# Altium project smart_mask_v_1_0.PrjPcb
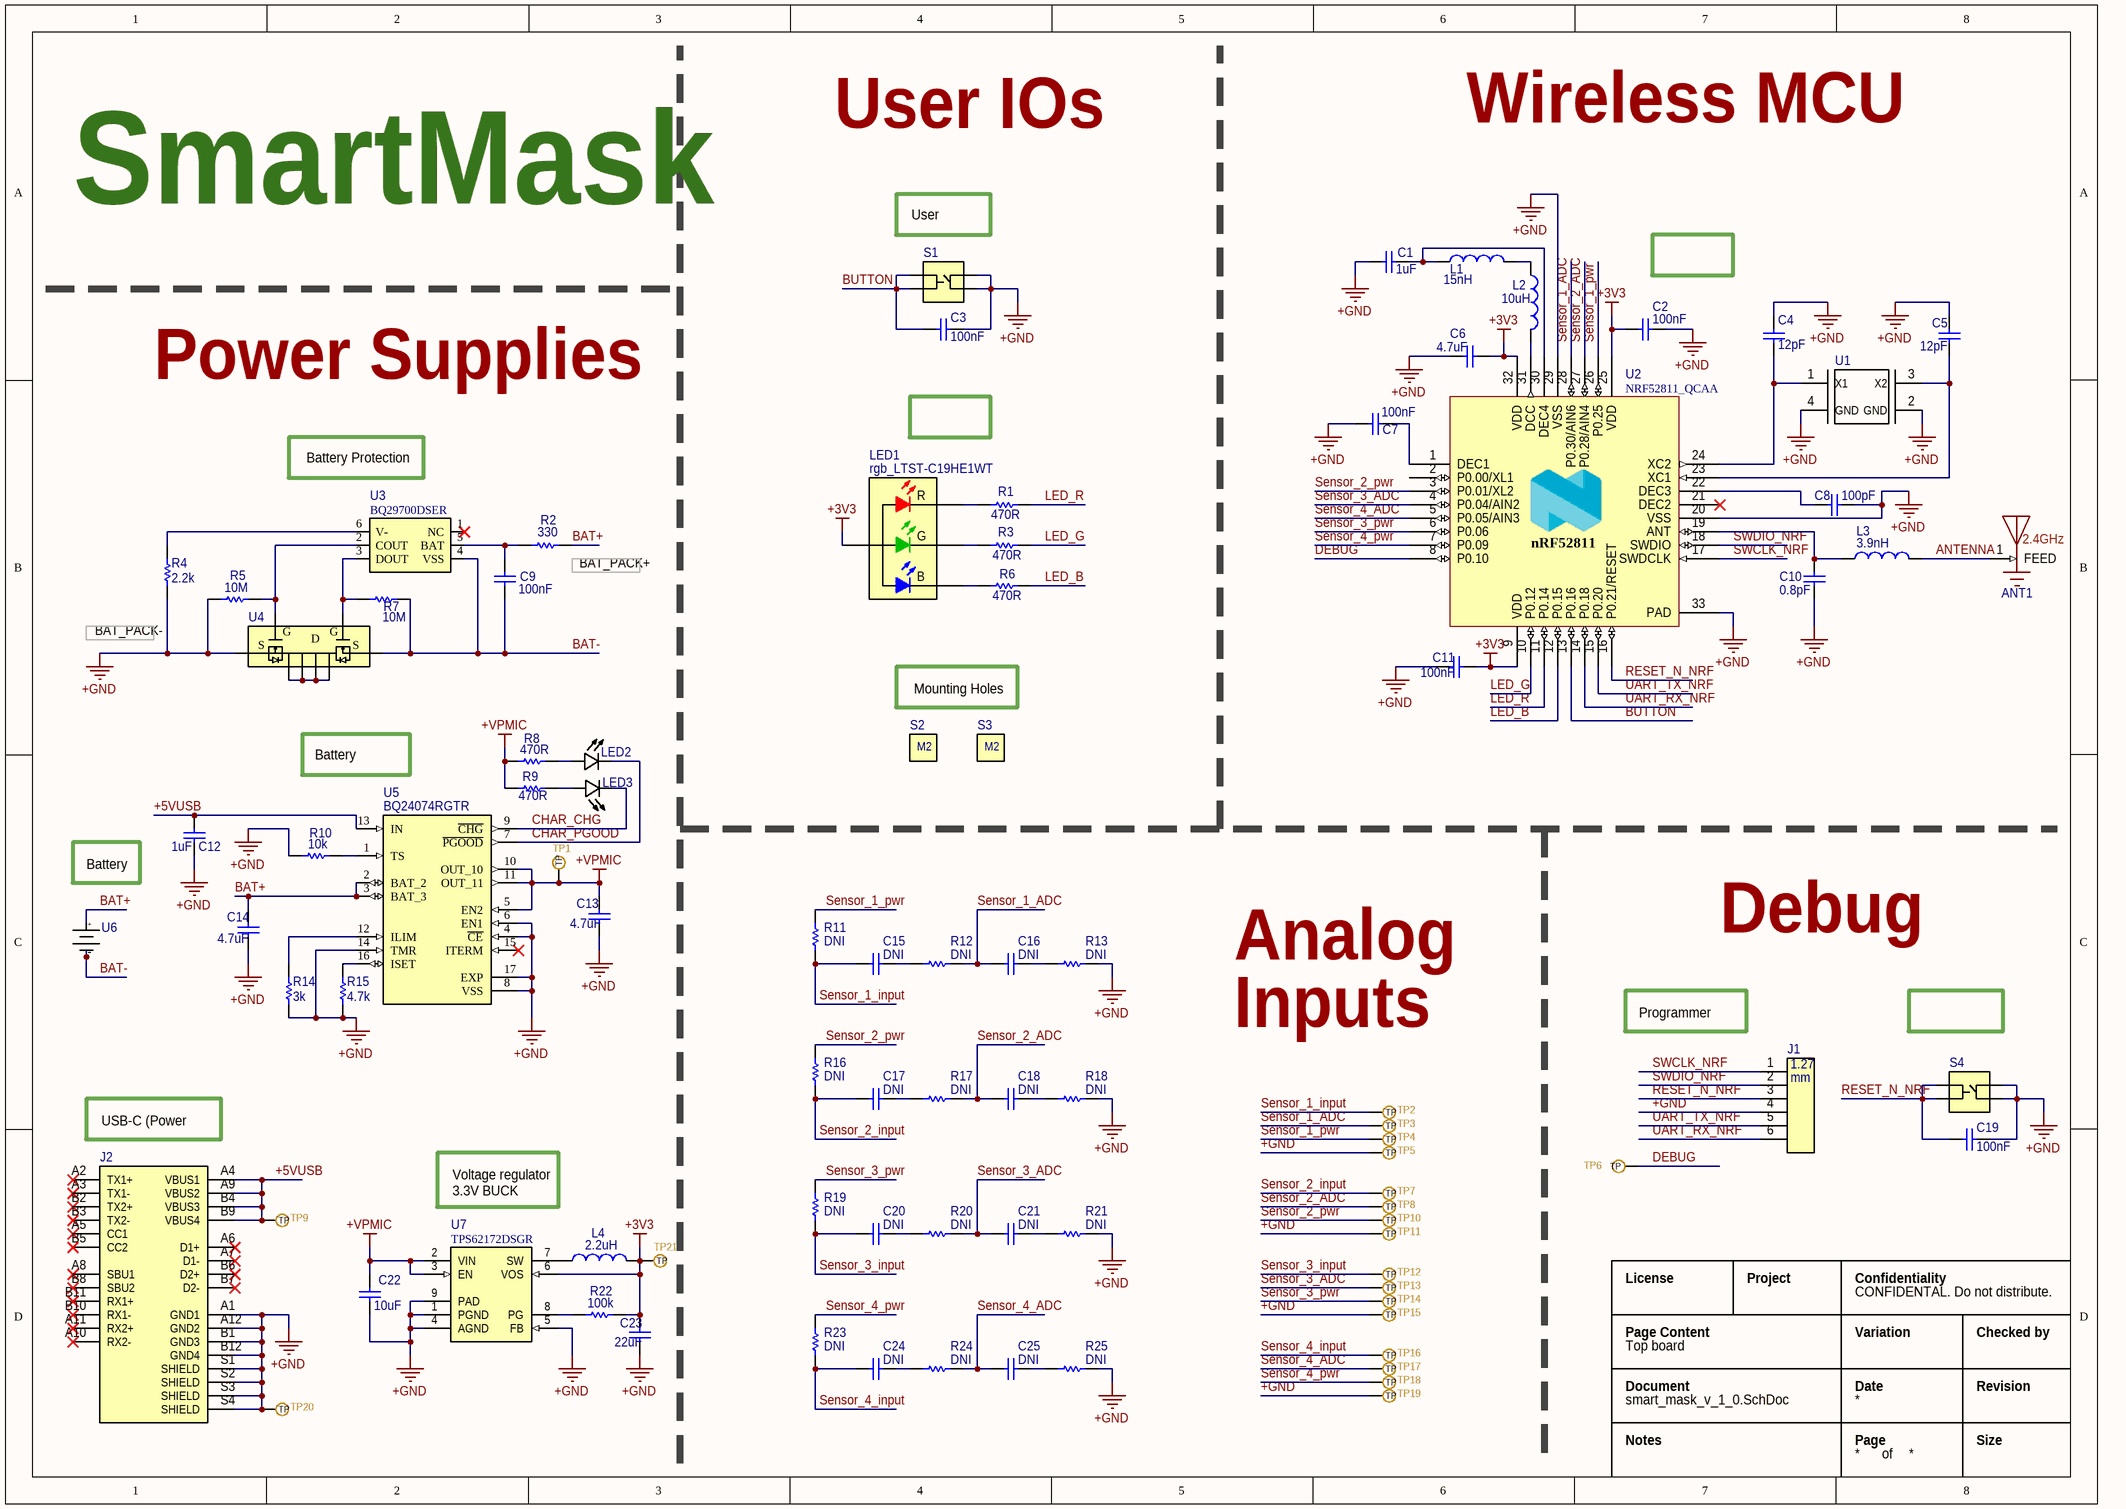
[diagram p0: smart_mask_v_1_0.SchDoc]
1 sheet, 92 parts. Net scope: global (net labels, ports and power ports of the same name join across sheets).
Board file: smart_mask_v_1_0.PcbDoc

## Sheet smart_mask_v_1_0.SchDoc
size A3

### Parts
ANT1  2450AT43F0100E  [ANT_2450AT43F0100E]  (value not drawn)
C1  value 1uF  [C0603]  (hidden comment: Multilayer Ceramic Capacitor)
C2  value 100nF  [C0402]  (hidden comment: Multilayer Ceramic Capacitor)
C3  value 100nF  [C0402]  (hidden comment: Multilayer Ceramic Capacitor)
C4  value 12pF  [C0402]  (hidden comment: Multilayer Ceramic Capacitor)
C5  value 12pF  [C0402]  (hidden comment: Multilayer Ceramic Capacitor)
C6  value 4.7uF  [C0603]  (hidden comment: Multilayer Ceramic Capacitor)
C7  value 100nF  [C0402]  (hidden comment: Multilayer Ceramic Capacitor)
C8  value 100pF  [C0402]  (hidden comment: Multilayer Ceramic Capacitor)
C9  value 100nF  [C0402]  (hidden comment: Multilayer Ceramic Capacitor)
C10  value 0.8pF  [C0402]  (hidden comment: Multilayer Ceramic Capacitor)
C11  value 100nF  [C0402]  (hidden comment: Multilayer Ceramic Capacitor)
C12  value 1uF  [C0402]  (hidden comment: Multilayer Ceramic Capacitor)
C13  value 4.7uF  [C0402]  (hidden comment: Multilayer Ceramic Capacitor)
C14  value 4.7uF  [C0402]  (hidden comment: Multilayer Ceramic Capacitor)
C15  value DNI  [C0603_DNI]  (hidden comment: Multilayer Ceramic Capacitor)
C16  value DNI  [C0603_DNI]  (hidden comment: Multilayer Ceramic Capacitor)
C17  value DNI  [C0603_DNI]  (hidden comment: Multilayer Ceramic Capacitor)
C18  value DNI  [C0603_DNI]  (hidden comment: Multilayer Ceramic Capacitor)
C19  value 100nF  [C0402]  (hidden comment: Multilayer Ceramic Capacitor)
C20  value DNI  [C0603_DNI]  (hidden comment: Multilayer Ceramic Capacitor)
C21  value DNI  [C0603_DNI]  (hidden comment: Multilayer Ceramic Capacitor)
C22  value 10uF  [C0402]  (hidden comment: Multilayer Ceramic Capacitor)
C23  value 22uF  [C0603]  (hidden comment: Multilayer Ceramic Capacitor)
C24  value DNI  [C0603_DNI]  (hidden comment: Multilayer Ceramic Capacitor)
C25  value DNI  [C0603_DNI]  (hidden comment: Multilayer Ceramic Capacitor)
J1  FTS-103-01-F-DV-TR  [CON_6_2_1.27_FTS_103_01]  (value not drawn)
J2  1054500101  [USB-C-1054500101]  (value not drawn)
L1  value 15nH  [L0402]  (hidden comment: IND 15nH 0402)
L2  value 10uH  [L0603]  (hidden comment: IND 10uH 0603)
L3  value 3.9nH  [L0402]  (hidden comment: IND 3.9nH 0402)
L4  value 2.2uH  [L0603]  (hidden comment: IND 2.2uH 0603)
LED1  rgb_LTST-C19HE1WT  [LTST-C19HE1WT-4_V]
LED2  LTST-C190CKT  [LTST-C190CKT]  (value not drawn)
LED3  LTST-C190CKT  [LTST-C190CKT]  (value not drawn)
R1  value 470R  [R0402]  (hidden comment: Thick Film)
R2  value 330  [R0402]  (hidden comment: Thick Film)
R3  value 470R  [R0402]  (hidden comment: Thick Film)
R4  value 2.2k  [R0402]  (hidden comment: Thick Film)
R5  value 10M  [R0402]  (hidden comment: Thick Film)
R6  value 470R  [R0402]  (hidden comment: Thick Film)
R7  value 10M  [R0402]  (hidden comment: Thick Film)
R8  value 470R  [R0402]  (hidden comment: Thick Film)
R9  value 470R  [R0402]  (hidden comment: Thick Film)
R10  value 10k  [R0402]  (hidden comment: Thick Film)
R11  value DNI  [R0603_DNI]  (hidden comment: RES DNI 0603)
R12  value DNI  [R0603_DNI]  (hidden comment: RES DNI 0603)
R13  value DNI  [R0603_DNI]  (hidden comment: RES DNI 0603)
R14  value 3k  [R0402]  (hidden comment: Thick Film)
R15  value 4.7k  [R0402]  (hidden comment: Thick Film)
R16  value DNI  [R0603_DNI]  (hidden comment: RES DNI 0603)
R17  value DNI  [R0603_DNI]  (hidden comment: RES DNI 0603)
R18  value DNI  [R0603_DNI]  (hidden comment: RES DNI 0603)
R19  value DNI  [R0603_DNI]  (hidden comment: RES DNI 0603)
R20  value DNI  [R0603_DNI]  (hidden comment: RES DNI 0603)
R21  value DNI  [R0603_DNI]  (hidden comment: RES DNI 0603)
R22  value 100k  [R0402]  (hidden comment: Thick Film)
R23  value DNI  [R0603_DNI]  (hidden comment: RES DNI 0603)
R24  value DNI  [R0603_DNI]  (hidden comment: RES DNI 0603)
R25  value DNI  [R0603_DNI]  (hidden comment: RES DNI 0603)
S1  TL1014BF160QG  [BUTTON_TL1014BF160QG]  (value not drawn)
S2  hole_M2  [M2_no_screw]  (value not drawn)
S3  hole_M2  [M2_no_screw]  (value not drawn)
S4  TL1014BF160QG  [BUTTON_TL1014BF160QG]  (value not drawn)
TP1  TP_1mm  [TP_1mm]  (value not drawn)
TP2  TP_2mm  [TP_2mm]  (value not drawn)
TP3  TP_2mm  [TP_2mm]  (value not drawn)
TP4  TP_2mm  [TP_2mm]  (value not drawn)
TP5  TP_2mm  [TP_2mm]  (value not drawn)
TP6  TP_2mm  [TP_2mm]  (value not drawn)
TP7  TP_2mm  [TP_2mm]  (value not drawn)
TP8  TP_2mm  [TP_2mm]  (value not drawn)
TP9  TP_1mm  [TP_1mm]  (value not drawn)
TP10  TP_2mm  [TP_2mm]  (value not drawn)
TP11  TP_2mm  [TP_2mm]  (value not drawn)
TP12  TP_2mm  [TP_2mm]  (value not drawn)
TP13  TP_2mm  [TP_2mm]  (value not drawn)
TP14  TP_2mm  [TP_2mm]  (value not drawn)
TP15  TP_2mm  [TP_2mm]  (value not drawn)
TP16  TP_2mm  [TP_2mm]  (value not drawn)
TP17  TP_2mm  [TP_2mm]  (value not drawn)
TP18  TP_2mm  [TP_2mm]  (value not drawn)
TP19  TP_2mm  [TP_2mm]  (value not drawn)
TP20  TP_1mm  [TP_1mm]  (value not drawn)
TP21  TP_1mm  [TP_1mm]  (value not drawn)
U1  ABM11W-32.0000MHZ-8-B1U-T3  [XTAL_32MHz_ABM11W-32.0000MHZ-8-B1U-T3]  (value not drawn)
U2  NRF52811_QCAA  [NRF52811_QCAA]
U3  BQ29700DSER  [BATT_PROTEC_BQ29700DSER]
U4  ECH8693R-TL-W  [MOSFET_2CHAN_ECH8693R-TL-W]  (value not drawn)
U5  BQ24074RGTR  [BATT_CHARG_BQ24074RGTR]
U6  RJD2430C1ST1  [COIN_BAT_110_MAH_RJD2430C1ST1]  (value not drawn)
U7  TPS62172DSGR  [REG_BUCK_TPS62172DSGR]

### Nets
+3V3: C2.2 C6.1 C11.1 C23.2 L4.2 LED1.4(A) R22.2 TP21.1(TP) U2.9(VDD) U2.25(VDD) U2.32(VDD) U7.6(VOS)
+GND: C1.1 C2.1 C3.2 C4.2 C5.2 C6.2 C7.2 C8.2 C10.1 C11.2 C12.1 C13.1 C14.1 C19.2 C22.1 C23.1 J1.4 J2.A1(GND1) J2.A12(GND2) J2.B1(GND3) J2.B12(GND4) J2.S1(SHIELD) J2.S2(SHIELD) J2.S3(SHIELD) J2.S4(SHIELD) R4.1 R5.2 R10.2 R13.2 R14.1 R15.1 R18.2 R21.2 R25.2 S1.2 S1.4 S4.2 S4.4 TP5.1(TP) TP11.1(TP) TP15.1(TP) TP19.1(TP) TP20.1(TP) U1.2(GND) U1.4(GND) U2.20(VSS) U2.29(VSS) U2.33(PAD) U4.1(S1) U5.4(~{CE}) U5.6(EN1) U5.8(VSS) U5.14(TMR) U5.17(EXP) U7.1(PGND) U7.4(AGND) U7.5(FB) U7.9(PAD)
+VPMIC: C13.2 C22.2 R8.2 R9.2 TP1.1(TP) U5.5(EN2) U5.10(OUT_10) U5.11(OUT_11) U7.2(VIN) U7.3(EN)
+5VUSB: C12.2 J2.A4(VBUS1) J2.A9(VBUS2) J2.B4(VBUS3) J2.B9(VBUS4) TP9.1(TP) U5.13(IN)
ANTENNA: ANT1.1(FEED) L3.2
BAT+: C14.2 R2.2 U5.2(BAT_2) U5.3(BAT_3) U6.1(+)
BAT-: C9.1 R7.1 U3.4(VSS) U4.3(S2) U6.2(-)
BUTTON: C3.1 S1.1 S1.3 U2.13(P0.16)
CHAR_CHG: LED3.C U5.9(~{CHG})
CHAR_PGOOD: LED2.C U5.7(~{PGOOD})
DEBUG: TP6.1(TP) U2.8(P0.10)
LED_B: R6.2 U2.12(P0.15)
LED_G: R3.2 U2.10(P0.12)
LED_R: R1.2 U2.11(P0.14)
RESET_N_NRF: C19.1 J1.3 S4.1 S4.3 U2.16(P0.21/RESET)
Sensor_1_ADC: C16.1 R12.2 TP3.1(TP) U2.28(P0.30/AIN6)
Sensor_1_input: C15.1 R11.1 TP2.1(TP)
Sensor_1_pwr: R11.2 TP4.1(TP) U2.26(P0.25)
Sensor_2_ADC: C18.1 R17.2 TP8.1(TP) U2.27(P0.28/AIN4)
Sensor_2_input: C17.1 R16.1 TP7.1(TP)
Sensor_2_pwr: R16.2 TP10.1(TP) U2.3(P0.01/XL2)
Sensor_3_ADC: C21.1 R20.2 TP13.1(TP) U2.4(P0.04/AIN2)
Sensor_3_input: C20.1 R19.1 TP12.1(TP)
Sensor_3_pwr: R19.2 TP14.1(TP) U2.6(P0.06)
Sensor_4_ADC: C25.1 R24.2 TP17.1(TP) U2.5(P0.05/AIN3)
Sensor_4_input: C24.1 R23.1 TP16.1(TP)
Sensor_4_pwr: R23.2 TP18.1(TP) U2.7(P0.09)
SWCLK_NRF: J1.1 U2.17(SWDCLK)
SWDIO_NRF: J1.2 U2.18(SWDIO)
UART_RX_NRF: J1.6 U2.14(P0.18)
UART_TX_NRF: J1.5 U2.15(P0.20)
NetC1_2: C1.2 L1.1 U2.30(DEC4)
NetC4_1: C4.1 U1.1(X1) U2.24(XC2)
NetC5_1: C5.1 U1.3(X2) U2.23(XC1)
NetC7_1: C7.1 U2.1(DEC1)
NetC8_1: C8.1 U2.22(DEC3)
NetC9_2: C9.2 R2.1 U3.5(BAT)
NetC10_2: C10.2 L3.1 U2.19(ANT)
NetC15_2: C15.2 R12.1
NetC16_2: C16.2 R13.1
NetC17_2: C17.2 R17.1
NetC18_2: C18.2 R18.1
NetC20_2: C20.2 R20.1
NetC21_2: C21.2 R21.1
NetC24_2: C24.2 R24.1
NetC25_2: C25.2 R25.1
NetL1_2: L1.2 L2.1
NetL2_2: L2.2 U2.31(DCC)
NetL4_1: L4.1 U7.7(SW)
NetLED1_1: LED1.1(R) R1.1
NetLED1_2: LED1.2(G) R3.1
NetLED1_3: LED1.3(B) R6.1
NetLED2_A: LED2.A R8.1
NetLED3_A: LED3.A R9.1
NetR4_2: R4.2 U3.6(V-)
NetR5_1: R5.1 U3.2(COUT) U4.2(G1)
NetR7_2: R7.2 U3.3(DOUT) U4.4(G2)
NetR10_1: R10.1 U5.1(TS)
NetR14_2: R14.2 U5.12(ILIM)
NetR15_2: R15.2 U5.16(ISET)
NetR22_1: R22.1 U7.8(PG)
NetU4_5: U4.5(D) U4.6(D) U4.7(D) U4.8(D)

Not connected (* = marked no-connect by the designer): J2 A2(TX1+)* A3(TX1-)* A5(CC1)* A6(D1+)* A7(D1-)* A8(SBU1)* A10(RX2-)* A11(RX2+)* B2(TX2+)* B3(TX2-)* B5(CC2)* B6(D2+)* B7(D2-)* B8(SBU2)* B10(RX1-)* B11(RX1+)*; U2 2(P0.00/XL1) 21(DEC2)*; U3 1(NC)*; U5 15(ITERM)*

### Notes on the sheet
- User IOs
- Wireless MCU
- SmartMask
- User button
- NRF52811
- Power Supplies
- LED RGB
- Battery Protection
- (near R2) BAT_PACK+
- (near R4) BAT_PACK-
- Mounting Holes
- Battery Charger
- Battery
- Analog
- Debug
- Inputs
- Programmer Pins
- Reset button
- (near J2) USB-C (Power Only)
- Voltage regulator
  3.3V BUCK
- License
- Project
- CONFIDENTAL. Do not distribute.
- Confidentiality
- Page Content
- Document
- Top board
- Variation
- Date
- Checked by
- Revision
- Notes
- Page
- of
- Size
- (in symbol 2450AT43F0100E) 2.4GHz
- (in symbol ECH8693R-TL-W) G; S
- (in symbol FTS-103-01-F-DV-TR) 1.27; mm
- (in symbol hole_M2) M2
- (in symbol NRF52811_QCAA) nRF52811

### Library data of the parts
ANT1 = 2450AT43F0100E: RF ANT 2.4GHZ CHIP SOLDER SMD; Manufacturer: Johanson Technology Inc.; ComponentLink1Description: Manufacturer URL; ComponentLink2Description: Datasheet; Link: https://www.digikey.com/en/products/detail/johanson-technology-inc/2450AT43F0100E/4824788; Supplier Part Number: 712-1600-1-ND; Supplier: Digikey; Price 1000+ Units USD: 0.36; Price 1 Unit USD: 0.84; Manufacturer Part Number: 2450AT43F0100E
C1 = CAP 1uF 0603: CAP CER 1UF 10V X5R 0603; Manufacturer Part Number: CL10A105KP8NNNC; Manufacturer: Samsung Electro-Mechanics; Voltage Rating: 16V; Supplier Part Number: 1276-1182-1-ND; Package: 0603; Link: https://www.digikey.com/product-detail/en/samsung-electro-mechanics/CL10A105KP8NNNC/1276-1182-1-ND/3889268; Supplier: Digikey
C2 C3 C7 C9 C11 C19 = CAP 100nF 0402: CAP CER 0.1UF 16V X7R 0402; Manufacturer Part Number: GRM155R71C104KA88J; Manufacturer: Murata Electronics; Supplier Part Number: 490-6328-1-ND; Voltage Rating: 16V; Package: 0402; Link: https://www.digikey.com/product-detail/en/murata-electronics/GRM155R71C104KA88J/490-6328-1-ND/3845525; Supplier: Digikey
C4 C5 = CAP 12pF 0402: CAP CER 12PF 50V C0G/NP0 0402; Manufacturer Part Number: GRM1555C1H120JA01J; Manufacturer: Murata Electronics; Supplier Part Number: 490-11375-1-ND; Voltage Rating: 50v; Package: 0402; Link: https://www.digikey.com/product-detail/en/murata-electronics/GRM1555C1H120JA01J/490-11375-1-ND/5333215; Supplier: Digikey
C6 = CAP 4.7uF 0603: CAP CER 4.7UF 10V X5R 0603; Manufacturer Part Number: CL10A475KP8NNNC; Manufacturer: Samsung Electro-Mechanics; Supplier Part Number: 1276-1044-1-ND; Voltage Rating: 10V; Package: 0603; Link: https://www.digikey.com/product-detail/en/samsung-electro-mechanics/CL10A475KP8NNNC/1276-1044-1-ND/3889130; Supplier: Digikey
C8 = CAP 100pF 0402: CAP CER 100PF 50V C0G/NP0 0402; Manufacturer Part Number: GRM1555C1H101JA01J; Manufacturer: Murata Electronics; Supplier Part Number: 490-7754-1-ND; Voltage Rating: 50v; Package: 0402; Link: https://www.digikey.com/product-detail/en/murata-electronics/GRM1555C1H101JA01J/490-7754-1-ND/4358006; Supplier: Digikey
C10 = CAP 0.8pF 0402: CAP CER 0.8PF 50V C0G/NP0 0402; Manufacturer Part Number: GRM1555C1HR80BA01J; Manufacturer: Murata Electronics; Supplier Part Number: 490-11411-1-ND; Voltage Rating: 50v; Package: 0402; Link: https://www.digikey.com/product-detail/en/murata-electronics/GRM1555C1HR80BA01J/490-11411-1-ND/5333251; Supplier: Digikey
C12 = CAP 1uF 0402: CAP CER 1UF 10V X6S 0402; Manufacturer Part Number: GRM155C81A105KA12D; Manufacturer: Murata Electronics; Supplier Part Number: 490-12699-1-ND; Voltage Rating: 10V; Package: 0402; Link: https://www.digikey.com/product-detail/en/murata-electronics/GRM155C81A105KA12D/490-12699-1-ND/5797668; Supplier: Digikey
C13 C14 = CAP 4.7uF 0402: CAP CER 4.7UF 6.3V X5R 0402; Manufacturer Part Number: GRM155R60J475ME47D; Manufacturer: Murata Electronics; Supplier Part Number: 490-5915-1-ND; Voltage Rating: 6.3V; Package: 0402; Link: https://www.digikey.com/product-detail/en/murata-electronics/GRM155R60J475ME47D/490-5915-1-ND/3719860; Supplier: Digikey
C15-C18 C20 C21 C24 C25 = Cap DNI 0603: DNI (Do Not Install)
C22 = CAP 10uF 0402: CAP CER 10UF 4V X5R 0402; Manufacturer Part Number: GRM155R60G106ME44D; Manufacturer: Murata Electronics; Supplier Part Number: 490-10693-1-ND; Voltage Rating: 4V; Package: 0402; Link: https://www.digikey.com/product-detail/en/murata-electronics/GRM155R60G106ME44D/490-10693-1-ND/5251412; Supplier: Digikey
C23 = CAP 22uF 0603: CAP CER 22UF 6.3V X5R 0603; Manufacturer Part Number: GRM188R60J226MEA0D; Manufacturer: Murata Electronics; Supplier Part Number: 490-7611-1-ND; Voltage Rating: 6.3V; Package: 0603; Link: https://www.digikey.com/product-detail/en/murata-electronics/GRM188R60J226MEA0D/490-7611-1-ND/4280544; Supplier: Digikey
J1 = FTS-103-01-F-DV-TR: CONN HEADER SMD 6POS 1.27MM; Manufacturer: Samtec Inc.; zz Current Rating Per Pin: 3.4A; Supplier Part Number: SAM14930CT-ND; Link: https://www.digikey.com/en/products/detail/samtec-inc/FTS-103-01-F-DV-TR/2649936; Manufacturer Part Number: FTS-103-01-F-DV-TR; Supplier: Digikey; Price 1000+ Units USD: 0.78; Price 1 Unit USD: 1.39
J2 = 1054500101: USB-C CONN RCP USB3.1 TYPEC 24P SMD RA; Manufacturer: Molex; zz Current Rating Per Pin: 0.25A, 1A, 5A; Supplier Part Number: WM12856CT-ND; Link: https://www.digikey.com/en/products/detail/molex/1054500101/5843890; Manufacturer Part Number: 1054500101; Supplier: Digikey; Price 1000+ Units USD: 2.19; Price 1 Unit USD: 1.10
L1 = IND 15nH 0402: FIXED IND 15NH 450MA 320 MOHM; Manufacturer: Murata Electronics; Manufacturer Part Number: LQG15HS15NJ02D; Tolerance: 5%; Supplier Part Number: 490-2625-1-ND; Package: 0603; Link: https://www.digikey.com/product-detail/en/murata-electronics/LQG15HS15NJ02D/490-2625-1-ND/662905; Supplier: Digikey
L2 = IND 10uH 0603: FIXED IND 10UH 50MA 900 MOHM SMD; Manufacturer: Murata Electronics; Manufacturer Part Number: LQM18FN100M00D; Tolerance: 20%; Supplier Part Number: 490-4025-1-ND; Package: 0603; Link: https://www.digikey.com/product-detail/en/murata-electronics/LQM18FN100M00D/490-4025-1-ND/1016285; Supplier: Digikey
L3 = IND 3.9nH 0402: FIXED IND 3.9NH 750MA 180 MOHM; Manufacturer: Murata Electronics; Manufacturer Part Number: LQG15HS3N9S02D; Tolerance: 5%; Supplier Part Number: 490-2617-1-ND; Package: 0603; Link: https://www.digikey.com/product-detail/en/murata-electronics/LQG15HS3N9S02D/490-2617-1-ND/662897; Supplier: Digikey
L4 = IND 2.2uH 0603: 2.2UH20% 1.05A(MAX) / 1.15A(TYP.; Manufacturer: Murata Electronics; Manufacturer Part Number: LQM18PN2R2MGHD; Tolerance: 20%; Supplier Part Number: 490-14478-6-ND; Package: 0603; Link: https://www.digikey.co.uk/product-detail/en/murata-electronics/LQM18PN2R2MGHD/490-14478-6-ND/6607082; Supplier: Digikey
LED1 = rgb_LTST-C19HE1WT: LED RGB DIFFUSED CHIP SMD / LED Tri-Color Blue/Green/Red, 5 V, -20 to 80 degC, 4-Pin SMD, RoHS, Tape and Reel; Manufacturer: Lite-On Inc.; zz Package: 0606; zz Power Supply Rating: 2.1V Red, 3.35V Green, 3.35V Blue; Supplier: Digikey; Manufacturer Part Number: LTST-C19HE1WT; Link: https://www.digikey.com/product-detail/en/lite-on-inc/LTST-C19HE1WT/160-2162-1-ND/4866310; Price 1 Unit USD: 0.56; Price 1000+ Units USD: 0.13; Supplier Part Number: 160-2162-1-ND
LED2 LED3 = LTST-C190CKT: LED RED CLEAR CHIP SMD; Manufacturer: Lite-On Inc.; zz Package: 0603 Lite-On; Supplier Part Number: 160-1181-1-ND; Manufacturer Part Number: LTST-C190CKT; Link: https://www.digikey.co.uk/product-detail/en/lite-on-inc/LTST-C190CKT/160-1181-1-ND/269253?utm_source=snapeda&utm_medium=aggregator&utm_campaign=symbol; Supplier: Digikey; Price 1 Unit USD: 0.05; Price 1000+ Units USD: 0.31
R1 R3 R6 R8 R9 = RES 470R 0402: RES SMD 470 OHM 1% 1/16W 0402; Manufacturer: Yageo; Manufacturer Part Number: RC0402FR-07470RL; Supplier Part Number: 311-470LRCT-ND; Tolerance: 1%; Package: 0402; Power: 1/16W; Link: https://www.digikey.com/product-detail/en/yageo/RC0402FR-07470RL/311-470LRCT-ND/729566; Supplier: Digikey
R2 = RES 330R 0402: RES SMD 330 OHM 1% 1/16W 0402; Manufacturer: Yageo; Manufacturer Part Number: RC0402FR-07330RL; Supplier Part Number: 311-330LRCT-ND; Tolerance: 1%; Package: 0402; Power: 1/16W; Link: https://www.digikey.co.uk/product-detail/en/yageo/RC0402FR-07330RL/311-330LRCT-ND/729541; Supplier: Digikey
R4 = RES 2.2k 0402: RES SMD 2.2K OHM 1% 1/16W 0402; Manufacturer: Yageo; Manufacturer Part Number: RC0402FR-072K2L; Supplier Part Number: 311-2.20KLRCT-ND; Tolerance: 1%; Package: 0402; Power: 1/16W; Link: https://www.digikey.co.uk/product-detail/en/yageo/RC0402FR-072K2L/311-2-20KLRCT-ND/729500; Supplier: Digikey
R5 R7 = RES 10M 0402: RES SMD 10 MOHM 1% 1/16W 0402; Manufacturer: Yageo; Manufacturer Part Number: RC0402FR-0710ML; Supplier Part Number: 311-10.0MLRCT-ND; Tolerance: 1%; Package: 0402; Power: 1/16W; Link: https://www.digikey.co.uk/product-detail/en/yageo/RC0402FR-0710ML/311-10-0MLRCT-ND/2827890; Supplier: Digikey
R10 = RES 10k 0402: RES SMD 10K OHM 1% 1/16W 0402; Manufacturer: Yageo; Manufacturer Part Number: RC0402FR-0710KL; Supplier Part Number: 311-10.0KLRCT-ND; Tolerance: 1%; Package: 0402; Power: 1/16W; Link: https://www.digikey.com/product-detail/en/yageo/RC0402FR-0710KL/311-10-0KLRCT-ND/729470; Supplier: Digikey
R11-R13 R16-R21 R23-R25 = RES DNI 0603: DNI (Do Not Install)
R14 = RES 3k 0402: RES SMD 10K OHM 1% 1/16W 0402; Manufacturer: Yageo; Manufacturer Part Number: RC0402FR-073KL; Supplier Part Number: 311-3KLRCT-ND; Tolerance: 1%; Package: 0402; Power: 1/16W; Link: https://www.digikey.co.uk/product-detail/en/yageo/RC0402FR-073KL/311-3KLRCT-ND/2827904; Supplier: Digikey
R15 = RES 4.7k 0402: RES SMD 4.7K OHM 1% 1/16W 0402; Manufacturer: Yageo; Manufacturer Part Number: RT0402FRE074K7L; Supplier Part Number: YAG3347CT-ND; Tolerance: 1%; Power: 1/16W; Link: https://www.digikey.co.uk/product-detail/en/yageo/RT0402FRE074K7L/YAG3347CT-ND/5418052; Supplier: Digikey
R22 = RES 100k 0402: RES SMD 100K OHM 1% 1/16W 0402; Manufacturer: Yageo; Manufacturer Part Number: RC0402FR-07100KL; Supplier Part Number: 311-100KLRCT-ND; Tolerance: 1%; Power: 1/16W; Link: https://www.digikey.co.uk/product-detail/en/yageo/RC0402FR-07100KL/311-100KLRCT-ND/729473; Supplier: Digikey
S1 S4 = TL1014BF160QG: SWITCH TACTILE SPST-NO 0.05A 12V; Manufacturer: E-Switch; ComponentLink1Description: Manufacturer URL; ComponentLink2URL: http://spec_sheets.e-switch.com/specs/P410002.pdf; ComponentLink2Description: Datasheet; Link: https://www.digikey.com/product-detail/en/e-switch/TL1014BF160QG/EG5042CT-ND/3910808; Supplier Part Number: EG5042CT-ND; Supplier: Digikey; Price 1000+ Units USD: 0.40; Price 1 Unit USD: 0.65; Manufacturer Part Number: TL1014BF160QG
S2 S3 = hole_M2: Mounting hole  M2 size, no solder stop, so no screw
TP1 TP9 TP20 TP21 = TP_1mm: Test point 1mm diameter; ComponentLink1Description: Manufacturer URL; ComponentLink2Description: Datasheet; Supplier: Digikey
TP2-TP8 TP10-TP19 = TP_2mm: Test point 2mm diameter; ComponentLink1Description: Manufacturer URL; ComponentLink2Description: Datasheet; Supplier: Digikey
U1 = ABM11W-32.0000MHZ-8-B1U-T3: CRYSTAL 32.0000MHZ 8PF SMD; Manufacturer: Abracon LLC; ComponentLink1Description: Manufacturer URL; ComponentLink2Description: Datasheet; Link: https://www.digikey.com/product-detail/en/abracon-llc/ABM11W-32-0000MHZ-8-B1U-T3/535-13899-1-ND/7173084; Supplier Part Number: 535-13899-1-ND; Supplier: Digikey; Price 1000+ Units USD: 0.43; Price 1 Unit USD: 0.75; Manufacturer Part Number: ABM11W-32.0000MHZ-8-B1U-T3
U2 = NRF52811_QCAA: NRF52811 Nordic Bluetooth 5.1 chip 32 pins QFN32; Manufacturer: Nordic Semiconductor; Manufacturer Part Number: 949-NRF52811-QCAA-R; ComponentLink1Description: Manufacturer URL; ComponentLink2Description: Datasheet; Link: https://eu.mouser.com/ProductDetail/Nordic-Semiconductor/nRF52811-QCAA-R?qs=gZXFycFWdAOUhCgQu7%252B6sA%3D%3D; Supplier Part Number: nRF52811-QCAA-R; Supplier: Mouser; Price 1000+ Units USD: 1.64; Price 1 Unit USD: 3.29
U3 = BQ29700DSER: BATT LITHIUM BATT PROTECT 6-SON; Manufacturer: Texas Instruments; ComponentLink1Description: Manufacturer URL; ComponentLink2Description: Datasheet; Link: https://www.digikey.com/product-detail/en/texas-instruments/BQ29700DSER/296-43985-1-ND/5973209; Supplier Part Number: 296-43985-1-ND; Supplier: Digikey; Price 1000+ Units USD: 0.21; Price 1 Unit USD: 0.56; Manufacturer Part Number: BQ29700DSER
U4 = ECH8693R-TL-W: MOSFET 2N-CH 24V 14A SOT-28; Manufacturer: ON Semiconductor; ComponentLink1Description: Manufacturer URL; ComponentLink2Description: Datasheet; Link: https://www.digikey.com/product-detail/en/on-semiconductor/ECH8693R-TL-W/ECH8693R-TL-WOSCT-ND/5969317; Supplier Part Number: ECH8693R-TL-WOSCT-ND; Supplier: Digikey; Price 1000+ Units USD: 0.53; Price 1 Unit USD: 0.20; Manufacturer Part Number: ECH8693R-TL-W
U5 = BQ24074RGTR: BATT LI-ION CHARGE MGMT 16-QFN; Manufacturer: Texas Instruments; ComponentLink1Description: Manufacturer URL; ComponentLink2Description: Datasheet; Link: https://www.digikey.com/product-detail/en/texas-instruments/BQ24074RGTR/296-38873-1-ND/5142985; Supplier Part Number: 296-38873-1-ND; Supplier: Digikey; Price 1000+ Units USD: 1.01; Price 1 Unit USD: 2.21; Manufacturer Part Number: BQ24074RGTR
U6 = RJD2430C1ST1: BATTERY LITHIUM 110mAh 3.7V COIN 24.5MM; Manufacturer: Illinois Capacitor; ComponentLink1Description: Manufacturer URL; ComponentLink2Description: Datasheet; Link: https://www.digikey.com/en/products/detail/illinois-capacitor/RJD2430C1ST1/6596418?s=N4IgTCBcDaIEoCkAiYAsBmADAYQIwGUAVXEAXQF8g; Supplier Part Number: 1572-1630-ND; Supplier: Digikey; Price 1000+ Units USD: 7.00; Price 1 Unit USD: 11.00; Manufacturer Part Number: RJD2430C1ST1
U7 = TPS62172DSGR: REG BUCK 3.3V 500MA 8WSON; Manufacturer: Texas Instruments; ComponentLink1Description: Manufacturer URL; ComponentLink2Description: Datasheet; Link: https://www.digikey.com/product-detail/en/texas-instruments/TPS62172DSGR/296-39449-1-ND/5143397; Supplier Part Number: 296-39449-1-ND; Supplier: Digikey; Price 1000+ Units USD: 0.54; Price 1 Unit USD: 1.29; Manufacturer Part Number: TPS62172DSGR